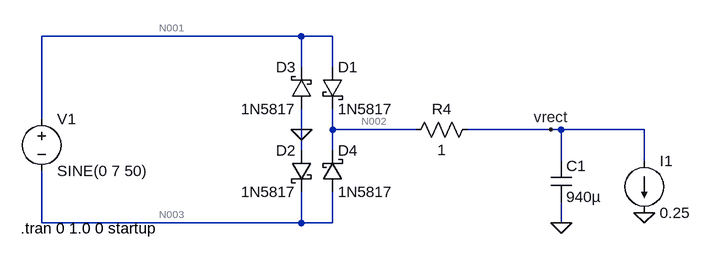
[diagram p0: schematic model.asc]
model.asc, the LTspice schematic file:
Version 4
SHEET 1 1720 680
WIRE 480 0 80 0
WIRE 528 0 480 0
WIRE 480 48 480 0
WIRE 528 48 528 0
WIRE 80 128 80 0
WIRE 480 144 480 112
WIRE 528 144 528 112
WIRE 656 144 528 144
WIRE 864 144 736 144
WIRE 880 144 864 144
WIRE 1008 144 880 144
WIRE 480 176 480 144
WIRE 528 176 528 144
WIRE 880 192 880 144
WIRE 1008 192 1008 144
WIRE 80 288 80 208
WIRE 480 288 480 240
WIRE 480 288 80 288
WIRE 528 288 528 240
WIRE 528 288 480 288
WIRE 880 288 880 256
FLAG 480 144 0
FLAG 864 144 vrect
FLAG 880 288 0
FLAG 1008 272 0
SYMBOL voltage 80 112 R0
WINDOW 123 0 0 Left 0
WINDOW 39 0 0 Left 0
SYMATTR InstName V1
SYMATTR Value SINE(0 7 50)
SYMBOL schottky 512 48 R0
SYMATTR InstName D1
SYMATTR Value 1N5817
SYMATTR Description Diode
SYMATTR Type diode
SYMBOL schottky 496 176 M0
SYMATTR InstName D2
SYMATTR Value 1N5817
SYMATTR Description Diode
SYMATTR Type diode
SYMBOL schottky 496 112 R180
WINDOW 0 24 64 Left 2
WINDOW 3 24 0 Left 2
SYMATTR InstName D3
SYMATTR Value 1N5817
SYMATTR Description Diode
SYMATTR Type diode
SYMBOL schottky 512 240 M180
WINDOW 0 24 64 Left 2
WINDOW 3 24 0 Left 2
SYMATTR InstName D4
SYMATTR Value 1N5817
SYMATTR Description Diode
SYMATTR Type diode
SYMBOL cap 864 192 R0
SYMATTR InstName C1
SYMATTR Value 940µ
SYMBOL res 752 128 R90
WINDOW 0 0 56 VBottom 2
WINDOW 3 32 56 VTop 2
SYMATTR InstName R4
SYMATTR Value 1
SYMBOL current 1008 192 R0
WINDOW 123 0 0 Left 0
WINDOW 39 0 0 Left 0
SYMATTR InstName I1
SYMATTR Value 0.25
TEXT 48 296 Left 2 !.tran 0 1.0 0 startup

The netlist it stands for:
* model.asc
V1 N001 N003 SINE(0 7 50)
D1 N001 N002 1N5817
D2 0 N003 1N5817
D3 0 N001 1N5817
D4 N003 N002 1N5817
C1 vrect 0 940µ
R4 vrect N002 1
I1 vrect 0 0.25
.model D D
.lib standard.dio
.tran 0 1.0 0 startup
.backanno
.end

* Results of the author's LTspice run, read from the files saved beside the schematic
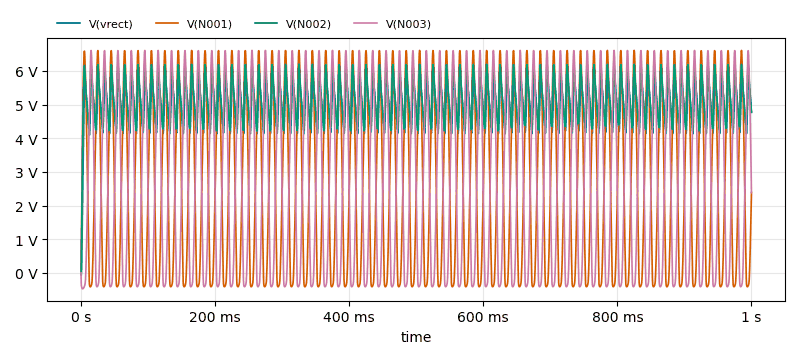
[diagram p1: Transient Analysis of model.asc, plotted from the saved traces]
* Transient Analysis, 1 run:
*   V(vrect): min -69.53 mV, max 5.739 V, average 4.966 V, rms 4.998 V, last 4.769 V
*   V(N001): min -415.7 mV, max 6.61 V, average 2.611 V, rms 3.618 V, last 2.385 V
*   V(N002): min -25.39 mV, max 6.202 V, average 5.22 V, rms 5.259 V, last 4.769 V
*   V(N003): min -475.1 mV, max 6.61 V, average 2.611 V, rms 3.62 V, last 2.385 V